# Altium schematic sheet USB3300-EZK-PHY.SchDoc
size A4
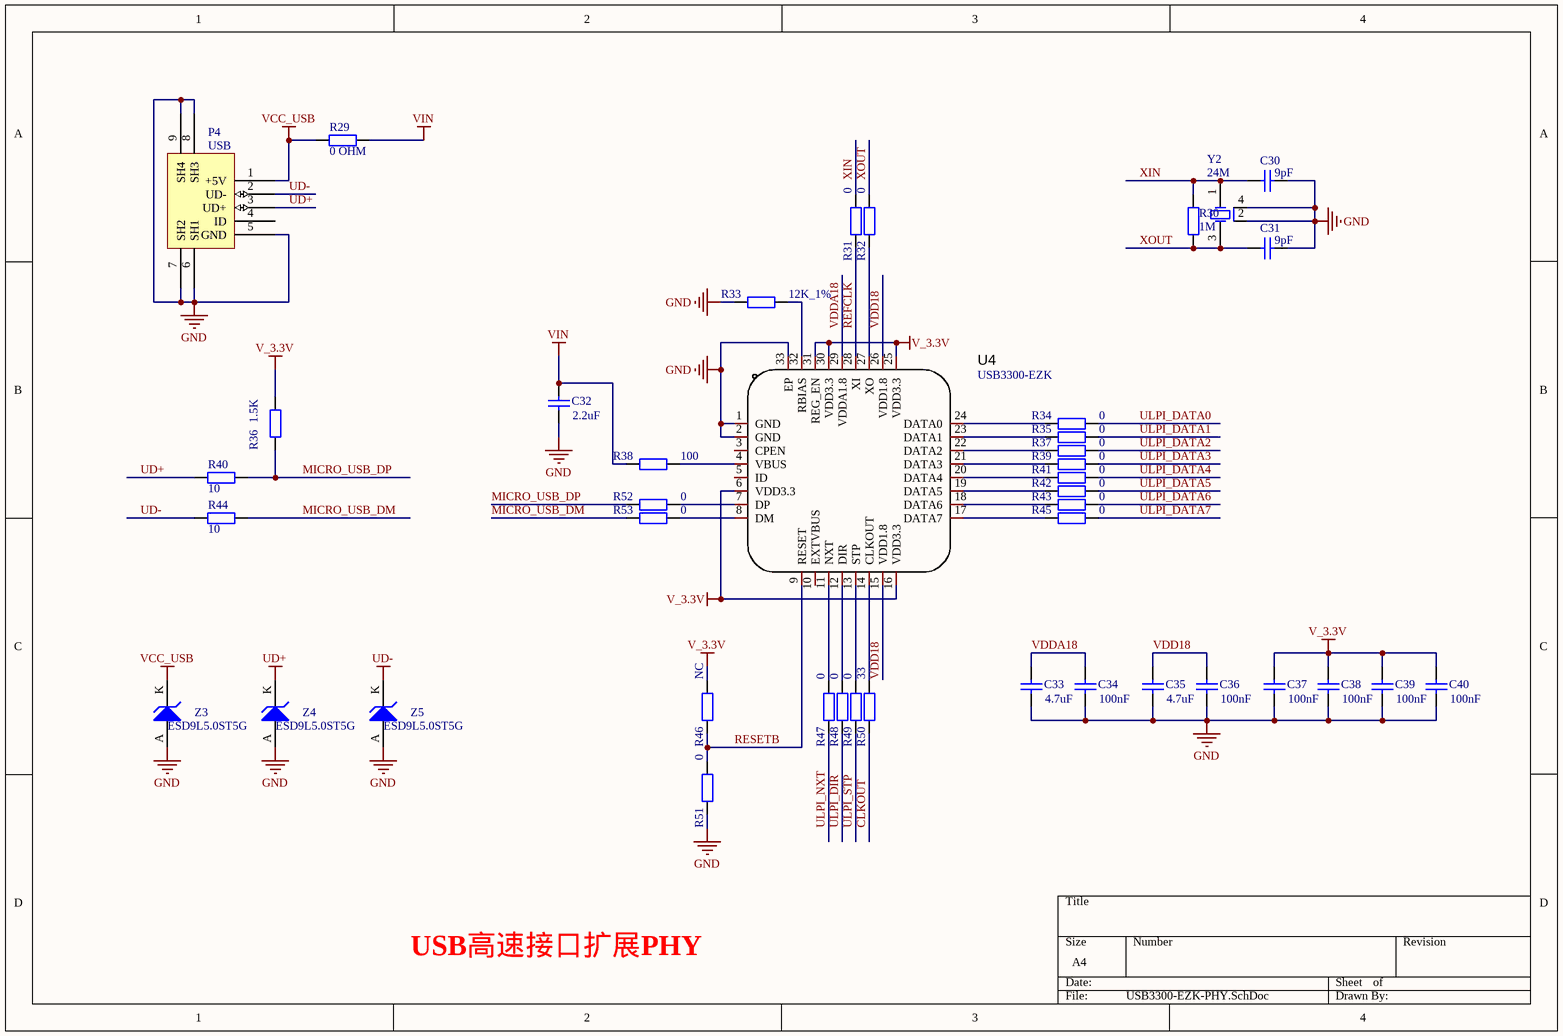
[diagram p0: USB3300-EZK-PHY.SchDoc]

## Parts
C30  9pF  [C0402]
C31  9pF  [C0402]
C32  2.2uF  [C0402]
C33  4.7uF  [C0402]
C34  100nF  [C0402]
C35  4.7uF  [C0402]
C36  100nF  [C0402]
C37  100nF  [C0402]
C38  100nF  [C0402]
C39  100nF  [C0402]
C40  100nF  [C0402]
P4  USB  [USB 牛角头]
R29  0 OHM  [R0402]
R30  1M  [R0402]
R31  0  [R0402]
R32  0  [R0402]
R33  12K_1%  [R0402]
R34  0  [R0402]
R35  0  [R0402]
R36  1.5K  [R0402]
R37  0  [R0402]
R38  100  [R0402]
R39  0  [R0402]
R40  10  [R0402]
R41  0  [R0402]
R42  0  [R0402]
R43  0  [R0402]
R44  10  [R0402]
R45  0  [R0402]
R46  NC  [R0402]
R47  0  [R0402]
R48  0  [R0402]
R49  0  [R0402]
R50  33  [R0402]
R51  0  [R0402]
R52  0  [R0402]
R53  0  [R0402]
U4  USB3300-EZK  [QFN-32_L5.0-W5.0-P0.50-BL-EP3.4]
Y2  24M  [CRYSTAL_3.2*2.5]
Z3  ESD9L5.0ST5G  [SOD-923]
Z4  ESD9L5.0ST5G  [SOD-923]
Z5  ESD9L5.0ST5G  [SOD-923]

## Nets
GND: C30.2 C31.2 C32.2 C33.2 C34.2 C35.2 C36.2 C37.2 C38.2 C39.2 C40.2 P4.5(GND) P4.6(SH1) P4.7(SH2) P4.8(SH3) P4.9(SH4) R33.2 R51.2 U4.1(GND) U4.2(GND) U4.33(EP) Y2.2(GROUND) Y2.4(GROUND) Z3.A Z4.A Z5.A
UD+: P4.3(UD+) R40.1 Z4.K
UD-: P4.2(UD-) R44.1 Z5.K
V_3.3V: C37.1 C38.1 C39.1 C40.1 R36.1 R46.1 U4.6(VDD3.3) U4.16(VDD3.3) U4.25(VDD3.3) U4.30(VDD3.3) U4.31(REG_EN)
VCC_USB: P4.1(+5V) R29.2 Z3.K
VIN: C32.1 R29.1 R38.2
CLKOUT: R50.2
MICRO_USB_DM: R44.2 R53.1
MICRO_USB_DP: R36.2 R40.2 R52.1
REFCLK: R31.2 U4.28(XI)
RESETB: R46.2 R51.1 U4.9(RESET)
ULPI_DATA0: R34.1
ULPI_DATA1: R35.1
ULPI_DATA2: R37.1
ULPI_DATA3: R39.1
ULPI_DATA4: R41.1
ULPI_DATA5: R42.1
ULPI_DATA6: R43.1
ULPI_DATA7: R45.1
ULPI_DIR: R48.2
ULPI_NXT: R47.2
ULPI_STP: R49.2
VDD18: C35.1 C36.1 U4.15(VDD1.8) U4.26(VDD1.8)
VDDA18: C33.1 C34.1 U4.29(VDDA1.8)
XIN: C30.1 R30.2 R31.1 Y2.1(INPUT)
XOUT: C31.1 R30.1 R32.1 Y2.3(OUTPUT)
NetR32_2: R32.2 U4.27(XO)
NetR33_1: R33.1 U4.32(RBIAS)
NetR34_2: R34.2 U4.24(DATA0)
NetR35_2: R35.2 U4.23(DATA1)
NetR37_2: R37.2 U4.22(DATA2)
NetR38_1: R38.1 U4.4(VBUS)
NetR39_2: R39.2 U4.21(DATA3)
NetR41_2: R41.2 U4.20(DATA4)
NetR42_2: R42.2 U4.19(DATA5)
NetR43_2: R43.2 U4.18(DATA6)
NetR45_2: R45.2 U4.17(DATA7)
NetR47_1: R47.1 U4.11(NXT)
NetR48_1: R48.1 U4.12(DIR)
NetR49_1: R49.1 U4.13(STP)
NetR50_1: R50.1 U4.14(CLKOUT)
NetR52_2: R52.2 U4.7(DP)
NetR53_2: R53.2 U4.8(DM)

Not connected (* = marked no-connect by the designer): P4 4(ID); U4 3(CPEN) 5(ID) 10(EXTVBUS)

## Notes on the sheet
- USB高速接口扩展PHY

## Library data of the parts
C30-C40 = Cap: Capacitor; Published: 8-Jun-2000; LatestRevisionDate: 17-Jul-2002; LatestRevisionNote: Re-released for DXP Platform.; PackageReference: RAD-0.3; Publisher: Altium Limited; PackageDescription: Radial Cap, Thru-Hole; 2 Leads; 0.3 in Pin Spacing
  C30 C31: Value: 9pF
  C32: Value: 2.2uF
  C33 C35: Value: 4.7uF
  C34 C36-C40: Value: 100nF
R29-R53 = Res2: Resistor; Published: 8-Jun-2000; LatestRevisionDate: 17-Jul-2002; LatestRevisionNote: Re-released for DXP Platform.; PackageReference: AXIAL-0.4; Publisher: Altium Limited; PackageDescription: Axial Device, Thru-Hole; 2 Leads; 0.4 in Pin Spacing
  R29: Value: 0 OHM
  R30: Value: 1M
  R31 R32 R34 R35 R37 R39 R41-R43 R45 R47-R49 R51-R53: Value: 0
  R33: Value: 12K_1%
  R36: Value: 1.5K
  R38: Value: 100
  R40 R44: Value: 10
  R46: Value: NC
  R50: Value: 33
U4 = USB3300-EZK: Manufacturer: MICROCHIP(美国微芯); Add into BOM: yes; Name: USB3300-EZK; Symbol: USB3300-EZK; Device: USB3300-EZK; LCSC Part Name: USB3300-EZK; Supplier Part: C108954; Manufacturer Part: USB3300-EZK; Supplier Footprint: QFN-32_5x5x05P; JLCPCB Part Class: Extended Part; Datasheet: https://atta.szlcsc.com/upload/public/pdf/source/20170620/1497944729272.pdf; Supplier: LCSC; Convert to PCB: yes
Y2 = CRYSTAL-PASSIVE_3225
Z3-Z5 = D Zener: Zener Diode; Published: 8-Jun-2000; LatestRevisionDate: 17-Jul-2002; LatestRevisionNote: Re-released for DXP Platform.; PackageReference: DIODE-0.7; Publisher: Altium Limited; PackageDescription: Diode, Thru-Hole; 2 Leads; 0.7 in Pin Spacing